# EAGLE design wearable_v4 (EAGLE 9.6.2)
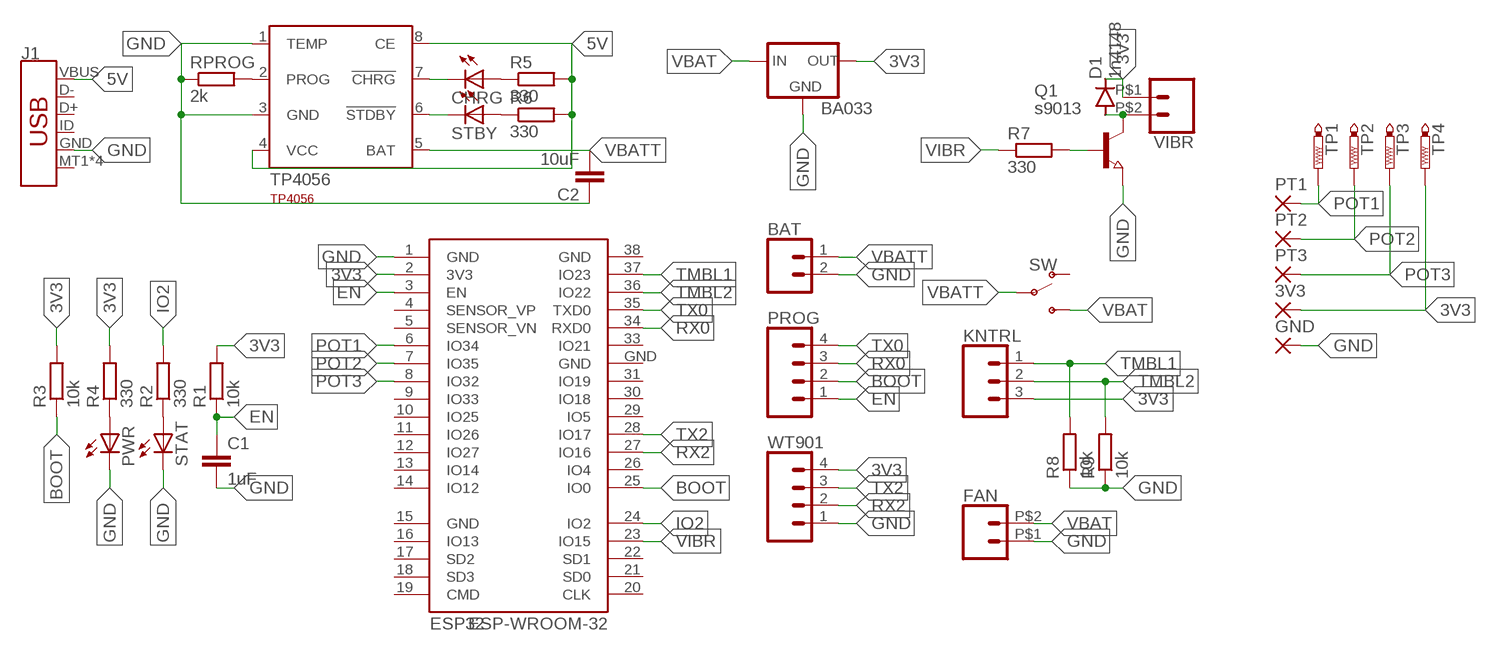
[diagram p0: schematic, sheet 1]

## Parts
3V3  WIREPADSMD1,27-254  [SMD1,27-2,54]
BA033  V_REG_78XX7812  [TO-252]
BAT  CONN_02-JST-2MM-SMT  [JST-2-SMD]
C1  1uF  C-EUC0805  [C0805]
C2  10uF  C-EUC0805  [C0805]
CHRG  LEDCHIPLED_0805  [CHIPLED_0805]
D1  1n4148  DIODE-SOD80C  [SOD80C]
ESP32  ESP-WROOM-32  [ESP-WROOM-32]
FAN  SOLDER_PAD_2  [SOLDER_PAD_2]
GND  WIREPADSMD1,27-254  [SMD1,27-2,54]
J1  USB_MICRO-B_SMT  [USB-MICROB]
KNTRL  3-PIN SMD  CONN_03JST-SMD  [JST-3-SMD]
PROG  CONN_04JST-SMD  [JST-4-SMD]
PT1  WIREPADSMD1,27-254  [SMD1,27-2,54]
PT2  WIREPADSMD1,27-254  [SMD1,27-2,54]
PT3  WIREPADSMD1,27-254  [SMD1,27-2,54]
PWR  LEDCHIPLED_0805  [CHIPLED_0805]
Q1  s9013  NPN-TRANSISTOR_SOT23  [SOT23]
R1  10k  R-EU_R0805  [R0805]
R2  330  R-EU_R0805  [R0805]
R3  10k  R-EU_R0805  [R0805]
R4  330  R-EU_R0805  [R0805]
R5  330  R-EU_R0805  [R0805]
R6  330  R-EU_R0805  [R0805]
R7  330  R-EU_R0805  [R0805]
R8  10k  R-EU_R0805  [R0805]
R9  10k  R-EU_R0805  [R0805]
RPROG  2k  R-EU_R0805  [R0805]
STAT  LEDCHIPLED_0805  [CHIPLED_0805]
STBY  LEDCHIPLED_0805  [CHIPLED_0805]
SW  SWITCH-SPDT-SMD-RIGHT-ANGLE  [SWITCH_SPST_SMD_A]
TP1  PTR1TP09R  [TP09R]
TP2  PTR1TP09R  [TP09R]
TP3  PTR1TP09R  [TP09R]
TP4  PTR1TP09R  [TP09R]
TP4056  TP4056  [SOT23-8]
VIBR  SOLDER_PAD_2  [SOLDER_PAD_2]
WT901  CONN_04JST-SMD  [JST-4-SMD]

## Nets
3V3: 3V3.1(P) BA033.2(OUT) D1.C ESP32.2(3V3) KNTRL.3 R1.2 R3.2 R4.2 TP4.TP VIBR.P$1 WT901.4
5V: J1.VBUS R5.2 R6.2 TP4056.4(VCC) TP4056.8(CE)
BOOT: ESP32.25(IO0) PROG.2 R3.1
EN: C1.1 ESP32.3(EN) PROG.1 R1.1
GND: BA033.3(GND) BAT.2 C1.2 C2.1 ESP32.1(GND) FAN.P$1 GND.1(P) J1.GND PWR.C Q1.2(E) R8.1 R9.1 RPROG.1 STAT.C TP4056.1(TEMP) TP4056.3(GND) WT901.1
IO2: ESP32.24(IO2) R2.2
N$1: R2.1 STAT.A
N$2: PWR.A R4.1
N$3: CHRG.A R5.1
N$4: R6.1 STBY.A
N$5: CHRG.C TP4056.7(!CHRG)
N$6: STBY.C TP4056.6(!STDBY)
N$8: RPROG.2 TP4056.2(PROG)
N$9: Q1.1(B) R7.2
N$10: D1.A Q1.3(C) VIBR.P$2
POT1: ESP32.6(IO34) PT1.1(P) TP1.TP
POT2: ESP32.7(IO35) PT2.1(P) TP2.TP
POT3: ESP32.8(IO32) PT3.1(P) TP3.TP
RX0: ESP32.34(RXD0) PROG.3
RX2: ESP32.27(IO16) WT901.2
TMBL1: ESP32.37(IO23) KNTRL.1 R8.2
TMBL2: ESP32.36(IO22) KNTRL.2 R9.2
TX0: ESP32.35(TXD0) PROG.4
TX2: ESP32.28(IO17) WT901.3
VBAT: BA033.1(IN) FAN.P$2 SW.3(S)
VBATT: BAT.1 C2.2 SW.2(P) TP4056.5(BAT)
VIBR: ESP32.23(IO15) R7.1
Unconnected: ESP32.4(SENSOR_VP) ESP32.5(SENSOR_VN) ESP32.9(IO33) ESP32.10(IO25) ESP32.11(IO26) ESP32.12(IO27) ESP32.13(IO14) ESP32.14(IO12) ESP32.16(IO13) ESP32.17(SD2) ESP32.18(SD3) ESP32.19(CMD) ESP32.20(CLK) ESP32.21(SD0) ESP32.22(SD1) ESP32.26(IO4) ESP32.29(IO5) ESP32.30(IO18) ESP32.31(IO19) ESP32.33(IO21) J1.D+ J1.D- J1.ID J1.MT1(SHIELD) J1.MT2(SHIELD) J1.P$1(SHIELD) J1.P$2(SHIELD) SW.1(O)

## Power pins joined to a net without a drawn wire
GND: ESP32.15(GND) ESP32.38(GND) ESP32.GND

## Library data of the parts
3V3 GND PT1-PT3 = wirepad:WIREPAD: Wire PAD connect wire on PCB
BA033 = SparkFun-IC-Power:V_REG_78XX: Voltage Regulator Standard 78xx regulator. IGO (Input Ground Output). Spark Fun Electronics SKU : COM-00107; PROD_ID: VREG-12370; VALUE: +12v
BAT = SparkFun-Connectors:CONN_02: Multi connection point. Often used as Generic Header-pin footprint for 0.1 inch spaced/style header connections On any of the 0.1 inch spaced packages, you can populate with these: Break Away Headers - Straight <https://www.sparkfun.com/products/116> (PRT-00116) Break Away Male Headers - Right Angle <https://www.sparkfun.com/products/553> (PRT-00553) Female Headers <https://www.sparkfun.com/products/115> (PRT-00115) Break Away Headers - Machine Pin <https://www.sparkfun.com/products/117> (PRT-00117) Break Away Female Headers - Swiss Machine Pin <https://www.sparkfun.com/products/743> (PRT-00743) For SCREWTERMINALS and SPRING TERMINALS visit here: Screw Terimnals on SparkFun.com <https://www.sparkfun.com/search/results?term=Screw+Terminals> (5mm/3.5mm/2.54mm spacing) This device is also useful as a general connection point to wire up your design to another part of your project. Our various solder wires solder well into these plated through hole pads. Hook-Up Wire - Assortment (Stranded, 22 AWG) <https://www.sparkfun.com/products/11375> (PRT-11375) Hook-Up Wire - Assortment (Solid Core, 22 AWG) <https://www.sparkfun.com/products/11367> (PRT-11367) View the entire wire category on our website here <https://www.sparkfun.com/categories/141> Special notes: Molex polarized connector foot print use with: PRT-08233 with associated crimp pins and housings. 2.54_SCREWTERM for use with PRT-10571. 3.5mm Screw Terminal footprints for PRT-08084 5mm Screw Terminal footprints for use with PRT-08432; PROD_ID: CONN-11443
C1 C2 = Clean-Kong:C-EU: CAPACITOR, European symbol
CHRG PWR STAT STBY = adafruit:LED: LED OSRAM: - CHIPLED LG R971, LG N971, LY N971, LG Q971, LY Q971, LO R971, LY R971 LH N974, LH R974 LS Q976, LO Q976, LY Q976 LO Q996 - Hyper CHIPLED LW Q18S LB Q993, LB Q99A, LB R99A - SideLED LS A670, LO A670, LY A670, LG A670, LP A670 LB A673, LV A673, LT A673, LW A673 LH A674 LY A675 LS A676, LA A676, LO A676, LY A676, LW A676 LS A679, LY A679, LG A679 - Hyper Micro SIDELED® LS Y876, LA Y876, LO Y876, LY Y876 LT Y87S - SmartLED LW L88C, LW L88S LB L89C, LB L89S, LG L890 LS L89K, LO L89K, LY L89K LS L896, LA L896, LO L896, LY L896 - TOPLED LS T670, LO T670, LY T670, LG T670, LP T670 LSG T670, LSP T670, LSY T670, LOP T670, LYG T670 LG T671, LOG T671, LSG T671 LB T673, LV T673, LT T673, LW T673 LH T674 LS T676, LA T676, LO T676, LY T676, LB T676, LH T676, LSB T676, LW T676 LB T67C, LV T67C, LT T67C, LS T67K, LO T67K, LY T67K, LW E67C LS E67B, LA E67B, LO E67B, LY E67B, LB E67C, LV E67C, LT E67C LW T67C LS T679, LY T679, LG T679 LS T770, LO T770, LY T770, LG T770, LP T770 LB T773, LV T773, LT T773, LW T773 LH T774 LS E675, LA E675, LY E675, LS T675 LS T776, LA T776, LO T776, LY T776, LB T776 LHGB T686 LT T68C, LB T68C - Hyper Mini TOPLED® LB M676 - Mini TOPLED Santana® LG M470 LS M47K, LO M47K, LY M47K Source: http://www.osram.convergy.de/
D1 = diode:DIODE-: DIODE
ESP32 = esp32:ESP-WROOM-32: Espressif Systems ESP-WROOM-32
FAN VIBR = SparkFun-Connectors:SOLDER_PAD_2: Solder Pad for LuMini Rings
J1 = SparkFun-Connectors:USB_MICRO-B: USB Type Micro-B Connector Male/female and PTH/SMT variants SparkFun Products: SparkFun microB USB Breakout <https://www.sparkfun.com/products/12035> SparkFun USB microB Plug Breakout <https://www.sparkfun.com/products/10031> SparkFun ESP8266 Thing <https://www.sparkfun.com/products/13231>; PROD_ID: CONN-09505; SF_ID: PRT-08533
KNTRL = SparkFun-Connectors:CONN_03: Multi connection point. Often used as Generic Header-pin footprint for 0.1 inch spaced/style header connections On any of the 0.1 inch spaced packages, you can populate with these: Break Away Headers - Straight <https://www.sparkfun.com/products/116> (PRT-00116) Break Away Male Headers - Right Angle <https://www.sparkfun.com/products/553> (PRT-00553) Female Headers <https://www.sparkfun.com/products/115> (PRT-00115) Break Away Headers - Machine Pin <https://www.sparkfun.com/products/117> (PRT-00117) Break Away Female Headers - Swiss Machine Pin <https://www.sparkfun.com/products/743> (PRT-00743) Stackable Header - 3 Pin (Female, 0.1") <https://www.sparkfun.com/products/13875> (PRT-13875) For SCREWTERMINALS and SPRING TERMINALS visit here: Screw Terimnals on SparkFun.com <https://www.sparkfun.com/search/results?term=Screw+Terminals> (5mm/3.5mm/2.54mm spacing) This device is also useful as a general connection point to wire up your design to another part of your project. Our various solder wires solder well into these plated through hole pads. Hook-Up Wire - Assortment (Stranded, 22 AWG) <https://www.sparkfun.com/products/11375> (PRT-11375) Hook-Up Wire - Assortment (Solid Core, 22 AWG) <https://www.sparkfun.com/products/11367> (PRT-11367) View the entire wire category on our website here <https://www.sparkfun.com/categories/141> Special notes: Molex polarized connector foot print use with SKU : PRT-08232 with associated crimp pins and housings.; PROD_ID: CONN-12591
PROG WT901 = SparkFun-Connectors:CONN_04: Multi connection point. Often used as Generic Header-pin footprint for 0.1 inch spaced/style header connections On any of the 0.1 inch spaced packages, you can populate with these: Break Away Headers - Straight <https://www.sparkfun.com/products/116> (PRT-00116) Break Away Male Headers - Right Angle <https://www.sparkfun.com/products/553> (PRT-00553) Female Headers <https://www.sparkfun.com/products/115> (PRT-00115) Break Away Headers - Machine Pin <https://www.sparkfun.com/products/117> (PRT-00117) Break Away Female Headers - Swiss Machine Pin <https://www.sparkfun.com/products/743> (PRT-00743) For SCREWTERMINALS and SPRING TERMINALS visit here: Screw Terimnals on SparkFun.com <https://www.sparkfun.com/search/results?term=Screw+Terminals> (5mm/3.5mm/2.54mm spacing) This device is also useful as a general connection point to wire up your design to another part of your project. Our various solder wires solder well into these plated through hole pads. Hook-Up Wire - Assortment (Stranded, 22 AWG) <https://www.sparkfun.com/products/11375> (PRT-11375) Hook-Up Wire - Assortment (Solid Core, 22 AWG) <https://www.sparkfun.com/products/11367> (PRT-11367) View the entire wire category on our website here <https://www.sparkfun.com/categories/141> Special notes: Molex polarized connector foot print use with SKU : PRT-08231 with associated crimp pins and housings. 1MM SMD Version SKU: PRT-10208
Q1 = semicon-smd-ipc:NPN-TRANSISTOR_: NPN TRANSISTOR
R1-R9 RPROG = Clean-Kong:R-EU_: RESISTOR, European symbol
SW = SparkFun-Switches:SWITCH-SPDT: Single Pole, Double Throw (SPDT) Switch Single-pole, double-throw (SPDT) switch. Variant Overview SMD-AYZ0202 Surface Mount DPDT Switch <https://www.sparkfun.com/products/597> (COM-00597) Used on e.g. LilyPad Arduino USB - ATmega32U4 Board <https://www.sparkfun.com/products/12049> PTH-11.6X4.0MM SPDT Mini Power Switch <https://www.sparkfun.com/products/102> (COM-00102) Used on e.g. SparkFun Simon Says - Through-Hole Soldering Kit <https://www.sparkfun.com/products/10547> (KIT-10547) PTH-11.6X4.0MM-KIT KIT version of SPDT Mini Power Switch - Simplifies soldering by removing tStop of switch pins - only one side can be soldered. PTH-11.6X4.0MM-LOCK LOCK version of SPDT Mini Power Switch - Offset pins hold switch in place for easier soldering. SMD-RIGHT-ANGLE Surface Mount Right Angle Switch <https://www.sparkfun.com/products/10860> (COM-10860) Used on e.g. SparkFun ESP8266 Thing <https://www.sparkfun.com/products/13231>; PROD_ID: SWCH-10651; SF_SKU: COM-10860
TP1-TP4 = testpad:PTR1: TEST PIN
TP4056 = tp4056:TP4056: TP4056 Data sheet <http://goo.gl/J7k8TF> Dave.Calaway Eagle Library <https://goo.gl/Muy1Tr>

## Board
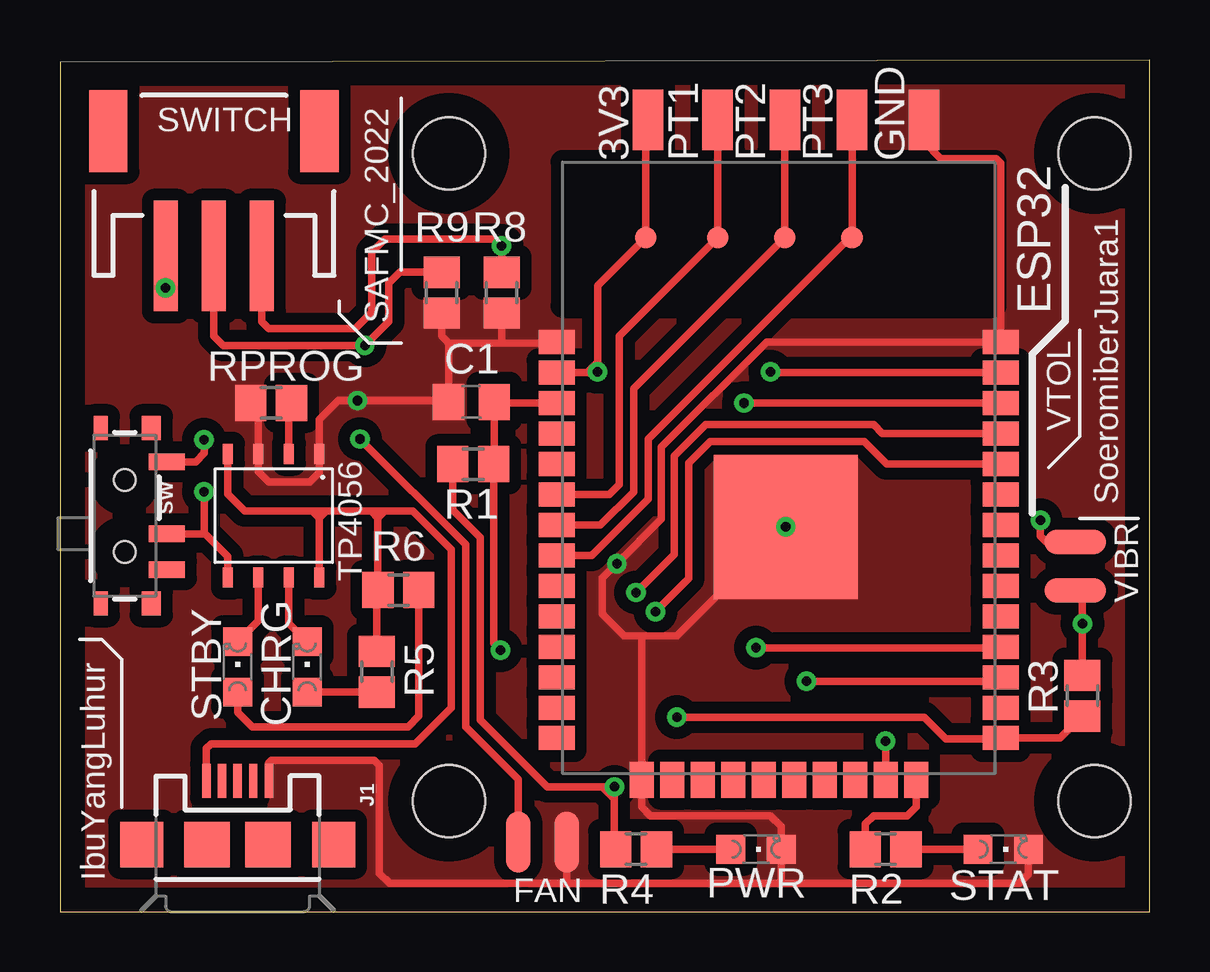
[diagram p1: board, top side]
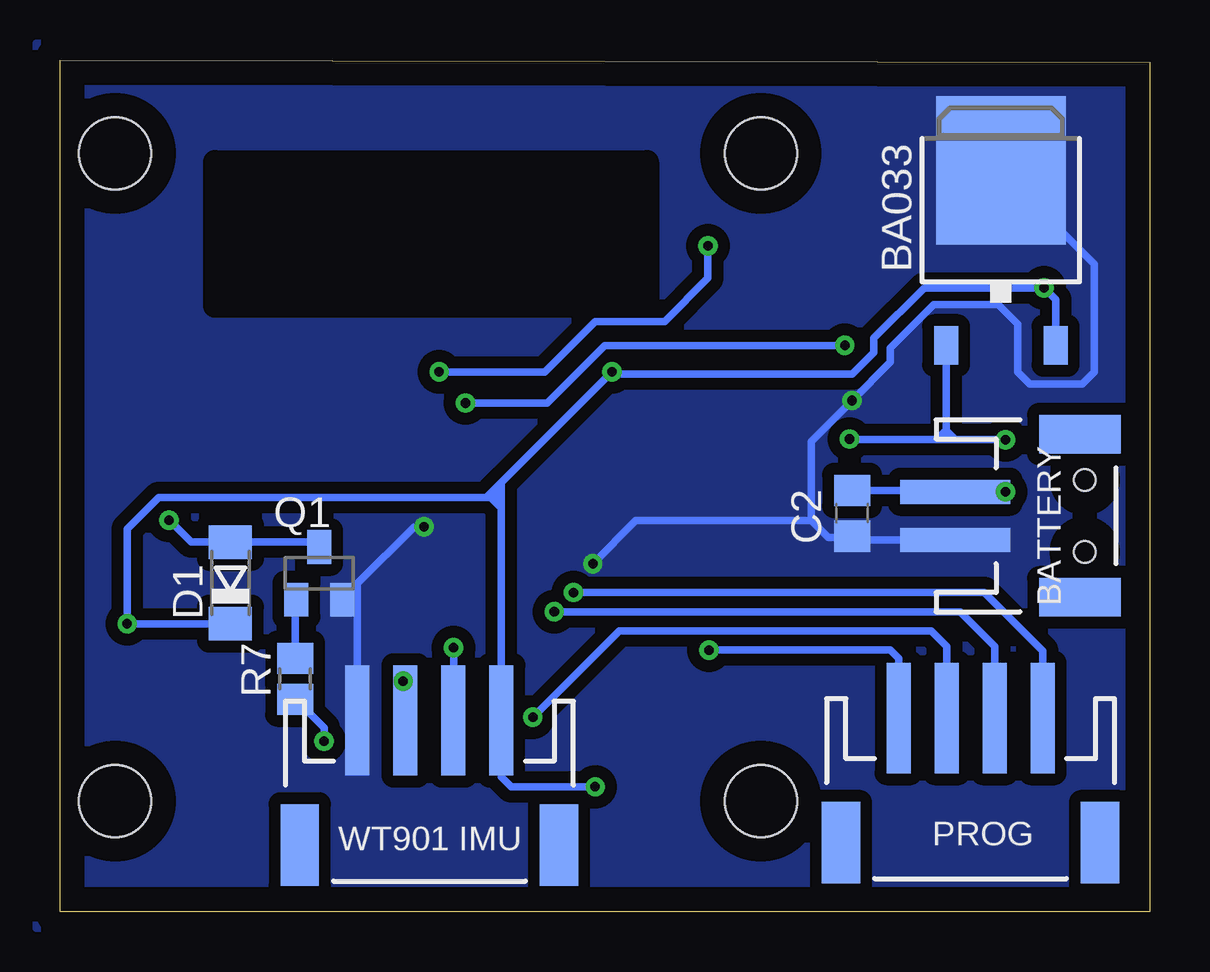
[diagram p2: board, bottom side, seen from below]

Size 45.4 x 35.5 mm. Coordinates in mm from the lower left corner, seen from the top.
Outline: 0,0 45.4,0 45.4,35.5 0,35.4 0,0
Copper layers (1*16): Top 0.035mm / dielectric 1.5mm / Bottom 0.035mm
Design rules "default": minimum track width 6mil, minimum drill 0.35mm, track to track 6mil, track to pad 6mil, pad to pad 6mil, via to via 6mil, smd to smd 6mil, copper to edge 40mil, drill to drill 6mil, minimum pad ring 10mil, minimum via ring 8mil, stop-mask expansion 4mil, vias tented up to drill 0mil, thermal gap 10mil
Holes 3 mm at 16.2,31.6 43.1,31.6 16.2,4.6 43.1,4.6

### Footprints (pad centres in the part's own frame; a part is rotated, then mirrored left to right if it is on the bottom)
SMD1,27-2,54 = smd 1.27 x 2.54: 1 0,0
TO-252 = smd 1 x 1.6: 1 -2.28,-4.8; 2 2.28,-4.8 | smd 5.4 x 6.2: 3 0,2.5
JST-2-SMD = smd 1 x 4.6: 1 -1,-3.7; 2 1,-3.7 | smd 1.6 x 3.4: NC1 -3.4,1.5; NC2 3.4,1.5
C0805 = smd 1.3 x 1.5: 1 -0.95,0; 2 0.95,0
CHIPLED_0805 = smd 1.2 x 1.2: A 0,-1.05; C 0,1.05
SOD80C = smd 1.4 x 1.8: A 1.7,0; C -1.7,0
ESP-WROOM-32 = smd 1.5 x 1: 1 -9.25,7; 2 -9.25,5.73; 3 -9.25,4.46; 4 -9.25,3.19; 5 -9.25,1.92; 6 -9.25,0.65; 7 -9.25,-0.62; 8 -9.25,-1.89; 9 -9.25,-3.16; 10 -9.25,-4.43; 11 -9.25,-5.7; 12 -9.25,-6.97; 13 -9.25,-8.24; 14 -9.25,-9.51; 25 9.25,-9.51; 26 9.25,-8.24; 27 9.25,-6.97; 28 9.25,-5.7; 29 9.25,-4.43; 30 9.25,-3.16; 31 9.25,-1.89; 32 9.25,-0.62; 33 9.25,0.65; 34 9.25,1.92; 35 9.25,3.19; 36 9.25,4.46; 37 9.25,5.73; 38 9.25,7 | smd 1 x 1.5: 15 -5.7,-11.25; 16 -4.43,-11.25; 17 -3.16,-11.25; 18 -1.89,-11.25; 19 -0.62,-11.25; 20 0.65,-11.25; 21 1.92,-11.25; 22 3.19,-11.25; 23 4.46,-11.25; 24 5.73,-11.25 | smd 6 x 6: GND 0.3,-0.7
SOLDER_PAD_2 = smd 1.016 x 2.54: P$1 -1.016,0; P$2 1.016,0
USB-MICROB = smd 1.4 x 0.35: D+ -2.65,0; D- -2.65,-0.65; GND -2.65,1.3; ID -2.65,0.65; VBUS -2.65,-1.3 | smd 1.9 x 1.8: MT1 0,-4; MT2 0,4 | smd 1.9 x 1.9: P$1 0,-1.27; P$2 0,1.27
JST-3-SMD = smd 1 x 4.6: 1 2.01,-4.77; 2 0.01,-4.77; 3 -1.99,-4.77 | smd 1.6 x 3.4: NC1 -4.39,0.43; NC2 4.41,0.43
JST-4-SMD = smd 1 x 4.6: 1 3.01,-4.77; 2 1.01,-4.77; 3 -0.99,-4.77; 4 -2.99,-4.77 | smd 1.6 x 3.4: NC1 -5.39,0.43; NC2 5.41,0.43
SOT23 = smd 1 x 1.4: 1 -0.95,-1.1; 2 0.95,-1.1; 3 0,1.1
R0805 = smd 1.3 x 1.5: 1 -0.85,0; 2 0.85,0
SWITCH_SPST_SMD_A = smd 0.7 x 1.5: 1 -2.25,-1.75; 2 -0.75,-1.75; 3 2.25,-1.75 | smd 1 x 0.6: GND1 -3.65,1; GND3 3.65,1 | smd 1 x 0.8: GND2 -3.65,-1.1; GND4 3.65,-1.1 | hole 0.9: -1.5,0; 1.5,0
TP09R = smd 0.9 x 0.9: TP 0,0
SOT23-8 = smd 0.42 x 0.835: 1 -1.905,-2.58; 2 -0.635,-2.58; 3 0.635,-2.58; 4 1.905,-2.58; 5 1.905,2.58; 6 0.635,2.58; 7 -0.635,2.58; 8 -1.905,2.58

### Placement (x,y rotation side)
3V3  24.5,33 0 top
BA033  6.2,28.4 0 bottom
BAT  4.4,16.5 270 bottom
C1  17.14,21.25 180 top
C2  12.4,16.6 90 bottom
CHRG  10.3,10.2 0 top
D1  38.3,13.7 90 bottom
ESP32  29.94,16.74 0 top
FAN  20.1,2.9 180 top
GND  36,33 0 top
J1  7.4,2.8 270 top
KNTRL  6.4,32.1 0 top
PROG  7.45,3.3 180 bottom
PT1  27.4,33 0 top
PT2  30.2,33 0 top
PT3  33,33 0 top
PWR  29,2.6 270 top
Q1  34.6,14.1 0 bottom
R1  17.22,18.65 180 top
R2  34.4,2.6 180 top
R3  42.6,9 90 top
R4  24,2.6 180 top
R5  13.2,10 90 top
R6  14.1,13.4 180 top
R7  35.6,9.7 90 bottom
R8  18.4,25.8 90 top
R9  15.9,25.8 90 top
RPROG  8.8,21.2 0 top
STAT  39.3,2.6 270 top
STBY  7.4,10.2 0 top
SW  2.7,16.5 90 top
TP1  27.4,28.1 0 top
TP2  30.2,28.1 0 top
TP3  33,28.1 0 top
TP4  24.4,28.1 0 top
TP4056  8.9,16.5 180 top
VIBR  42.3,14.4 90 top
WT901  30,3.2 180 bottom

### Tracks (layer width: path | path; a pad name or v marks a point on that pad's centre or on a via)
3V3  (via drill 0.4)
  Top 0.305: v4.4,26 KNTRL.3 | ESP32.2 21.97,22.47 | 3V3.1 24.4,32.9 TP4.TP 22.4,26.1 22.4,23.22 22.4,22.9 | R3.2 v42.6,12 42.6,13.08 VIBR.P$1 | R1.2 16.37,16.73 17.5,15.6 17.5,8 20.3,5.2 22.6,5.2 | R4.2 23.15,2.8 23.1,2.85 23.1,4.7 | 23.1,4.9 23.1,4.7 | 22.8,5.2 23.1,4.9 | 22.8,5.2 22.6,5.2 | 23.1,4.9 v23.1,5.2 22.8,5.2 | 22.6,5.2 23.1,4.7 | 22.4,22.9 21.97,22.47 | 21.97,22.47 22.37,22.47 v22.4,22.5 22.4,22.9
  Bottom 0.305: BA033.2 3.92,25.52 v4.4,26 9.4,26 11.5,23.9 11.5,23.3 12.4,22.4 22.3,22.4 v22.4,22.5 27.01,17.89 | D1.C v42.6,12 42.6,15.95 41.3,17.26 27.61,17.26 | 27.01,16.82 WT901.4 27.01,5.61 26.6,5.2 v23.1,5.2 | 27.01,16.82 27.01,17.26 | 27.01,17.26 27.01,17.48 | 27.01,17.48 27.01,17.89 | 27.45,17.26 27.01,17.26 | 27.01,17.89 27.34,17.56 | 27.34,17.56 27.61,17.29 27.61,17.26 | 27.01,17.48 27.09,17.56 27.34,17.56 | 27.01,16.82 27.45,17.26 | 27.45,17.26 27.61,17.26
5V
  Top 0.305: R5.2 13.2,13.35 R6.2 13.25,16.41 | 13.2,16.7 12.96,16.7 | 12.96,16.7 11.1,16.7 | 11.1,16.7 10.8,16.7 | 10.8,16.7 10.51,16.7 | 10.51,16.7 7.7,16.7 6.99,17.41 TP4056.4 | TP4056.8 10.8,16.41 | 10.8,16.41 10.8,16.7 | J1.VBUS 6.1,6.8 6.3,7 14.8,7 16.3,8.5 16.3,15.1 14.7,16.7 13.54,16.7 | 13.54,16.7 13.2,16.7 | 13.2,16.7 13.25,16.65 13.25,16.41 | 10.51,16.7 10.8,16.41 | 10.8,16.41 10.81,16.41 11.1,16.7 | 12.96,16.7 13.25,16.41 | 13.25,16.41 13.54,16.7
BOOT  (via drill 0.4)
  Top 0.305: R3.1 41.68,7.23 ESP32.25 39.16,7.2 36.9,7.2 36,8.1 v25.7,8.1
  Bottom 0.305: PROG.2 8.46,11.06 9.1,11.7 22.1,11.7 v25.7,8.1
EN  (via drill 0.4)
  Top 0.305: ESP32.3 18.14,21.2 C1.1 18.09,18.67 R1.1 18.07,11.18 v18.35,10.9
  Bottom 0.305: PROG.1 10.46,10.56 10.8,10.9 v18.35,10.9
GND  (via drill 0.4)
  Top 0.305: 8.06,21.09 RPROG.1 8.26,20.89 TP4056.3 8.26,18.34 8.7,17.9 10.4,17.9 10.8,18.3 TP4056.1 10.8,20.5 11.6,21.3 v12.4,21.3 16.19,21.3 | R9.1 15.9,24 16.2,23.7 | 16.2,23.7 18.4,23.7 | 18.4,23.7 20.65,23.7 ESP32.1 | C1.2 16.19,21.3 | 16.19,21.3 16.19,23.69 16.2,23.7 | R8.1 18.4,23.7 | STAT.C 40.35,1.55 39.97,1.17 30,1.17 | 21.1,1.17 30,1.17 | 30,1.17 30.05,1.22 PWR.C 30.05,3.55 29.6,4 24.6,4 24.24,4.36 ESP32.15 24.24,11.46 24.2,11.5 | J1.GND 8.7,6.2 8.8,6.3 13.1,6.3 13.3,6.1 13.3,1.6 13.73,1.17 21.1,1.17 | FAN.P$1 21.12,1.18 21.1,1.17 | GND.1 36,32.1 36.71,31.39 39,31.39 39.19,31.21 ESP32.38 29.44,23.74 25.06,19.36 25.06,16.36 v23.2,14.5 22.6,13.9 22.6,12.4 23.5,11.5 24.2,11.5 | 24.2,11.5 25.7,11.5 ESP32.GND
  Bottom 0.305: BAT.2 12.25,15.5 C2.1 12.45,15.6 13.4,15.6 14.1,16.3 | WT901.1 33.01,12.36 | 33.01,12.36 Q1.2 33.65,13.03 33.01,13.67 | BA033.3 2.3,27 2.3,22.5 2.8,22 5,22 5.5,22.5 5.5,24.5 6.3,25.3 9,25.3 10.8,23.5 10.8,22.9 v12.4,21.3 14.1,19.6 14.1,16.3 | 33.01,12.36 33.01,13.67 | 33.01,13.67 30.64,16.04 ESP32.GND | 14.1,16.3 21.4,16.3 v23.2,14.5
  other vias: 30.24,16.04
  pour Top (isolate 0.5, no thermals): -0.4,35.5 45.8,35.5 45.8,-0.2 -0.4,-0.2
  pour Bottom (isolate 0.5, no thermals): -0.8,36.2 -0.8,-0.7 46.4,-0.7 46.4,36.2
IO2
  Top 0.305: R2.2 33.55,3.65 33.9,4 35.3,4 35.67,4.37 ESP32.24
N$1
  Top 0.305: R2.1 STAT.A
N$2
  Top 0.305: R4.1 PWR.A
N$3
  Top 0.305: CHRG.A R5.1
N$4
  Top 0.305: STBY.A 7.4,8.3 8,7.7 14.5,7.7 14.95,8.15 R6.1
N$5
  Top 0.305: CHRG.C 9.54,12.02 TP4056.7
N$6
  Top 0.305: STBY.C 8.26,12.12 TP4056.6
N$8
  Top 0.305: TP4056.2 9.54,21.09 RPROG.2
N$9
  Bottom 0.305: R7.2 35.6,12.95 Q1.1
N$10  (via drill 0.4)
  Top 0.305: 41.75,15.42 VIBR.P$2 41.1,15.42 40.85,15.66 v40.85,16.31
  Bottom 0.305: Q1.3 34.8,15.4 D1.A 39.94,15.4 v40.85,16.31
POT1
  Top 0.305: ESP32.6 22.89,17.39 23.3,17.8 23.3,24 TP1.TP PT1.1
POT2
  Top 0.305: ESP32.7 22.52,16.12 23.9,17.5 23.9,21.8 TP2.TP PT2.1
POT3
  Top 0.305: ESP32.8 22.15,14.85 24.5,17.2 24.5,19.7 32.9,28.1 TP3.TP PT3.1
RX0  (via drill 0.4)
  Top 0.305: ESP32.34 34.44,18.66 33.5,19.6 27.1,19.6 26.2,18.7 26.2,13.89 v24.81,12.5
  Bottom 0.305: PROG.3 6.46,11.06 7.9,12.5 v24.81,12.5
RX2  (via drill 0.4)
  Top 0.305: ESP32.27 39.02,9.6 v31.1,9.6
  Bottom 0.305: v31.1,9.6 31.1,8.06 WT901.2
TMBL1  (via drill 0.4)
  Top 0.305: KNTRL.1 8.41,24.59 8.7,24.3 12.3,24.3 13,25 13,27.5 13.53,28.03 18.12,28.03 v18.4,27.75 R8.2 | ESP32.37 29.63,22.47 v29.6,22.5
  Bottom 0.305: v29.6,22.5 25.2,22.5 23.1,24.6 20.2,24.6 18.4,26.4 v18.4,27.75
TMBL2  (via drill 0.4)
  Top 0.305: KNTRL.2 6.41,23.99 6.8,23.6 v12.7,23.6 13.7,24.6 13.7,26.2 14.15,26.65 R9.2 | ESP32.36 v28.5,21.2
  Bottom 0.305: v28.5,21.2 25.1,21.2 22.7,23.6 v12.7,23.6
TX0  (via drill 0.4)
  Top 0.305: ESP32.35 34.27,19.93 33.9,20.3 26.9,20.3 25.6,19 25.6,14.89 v24.01,13.3
  Bottom 0.305: PROG.4 4.46,10.86 6.9,13.3 v24.01,13.3
TX2  (via drill 0.4)
  Top 0.305: ESP32.28 39.15,11 v29,11
  Bottom 0.305: v29,11 WT901.3
VBAT  (via drill 0.4)
  Top 0.305: FAN.P$2 19.08,5.52 16.9,7.7 16.9,15.3 v12.5,19.7 | SW.3 5.65,18.75 6,19.11 v6,19.66
  Bottom 0.305: BA033.1 8.48,20.05 | 8.48,20.05 8.48,19.68 | v12.5,19.7 12.48,19.68 8.87,19.68 | 8.87,19.68 8.48,19.68 | 8.48,19.68 8.11,19.68 | 8.11,19.68 6.02,19.68 v6,19.66 | 8.11,19.68 8.48,20.05 | 8.48,20.05 8.49,20.05 8.87,19.68
VBATT  (via drill 0.4)
  Top 0.305: TP4056.5 6.99,14.8 6.05,15.75 6,15.75 | SW.2 6,15.75 | 6,15.75 v6,17.5
  Bottom 0.305: C2.2 8.15,17.55 BAT.1 v6,17.5
VIBR  (via drill 0.4)
  Top 0.305: ESP32.23 v34.4,7.1
  Bottom 0.305: v34.4,7.1 34.4,7.65 R7.1

### Text on the board
tNames: SWITCH | SAFMC_2022 | VTOL | SoeromiberJuara1 | VIBR | IbuYangLuhur | FAN
bNames: BATTERY | PROG | WT901 IMU